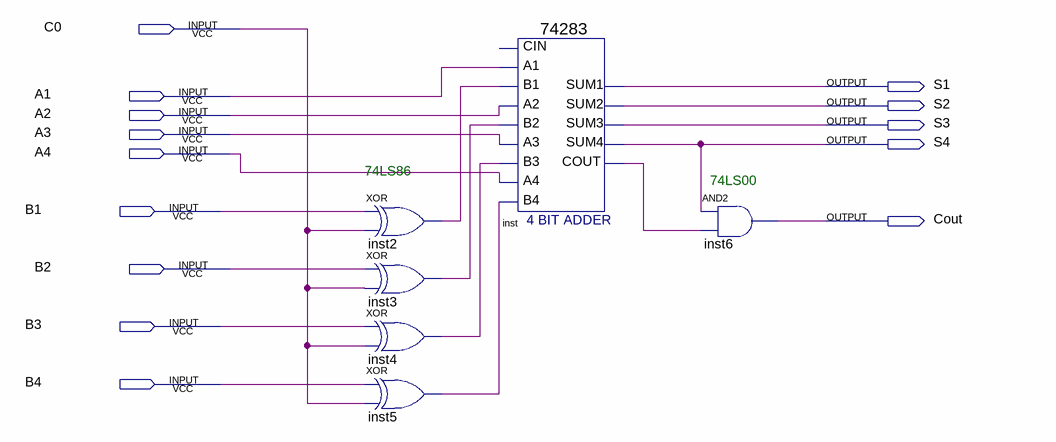
[diagram p0: schematic sheet]
// Quartus schematic Lab6Q2.bdf as structural Verilog: 6 symbols, 14 pins
module Lab6Q2 (
  input  C0,
  input  A1,
  input  A2,
  input  A3,
  input  A4,
  input  B1,
  input  B2,
  input  B3,
  input  B4,
  output S1,
  output S2,
  output S3,
  output S4,
  output Cout
);

  wire inst2_out, inst3_out, inst4_out, inst5_out, inst_cout;

  xor inst2 (inst2_out, B1, C0);
  xor inst3 (inst3_out, B2, C0);
  xor inst4 (inst4_out, B3, C0);
  xor inst5 (inst5_out, B4, C0);
  \74283  inst (
    .A1(A1), .A2(A2), .B2(inst3_out), .A3(A3), .A4(A4), .B4(inst5_out), .B1(inst2_out), .B3(inst4_out),
    .SUM4(S4), .COUT(inst_cout), .SUM1(S1), .SUM2(S2), .SUM3(S3));  // open: CIN
  and inst6 (Cout, S4, inst_cout);

  // Notes on the sheet:
  //   74LS86
  //   74LS00
endmodule
